# Altium schematic sheet амема.SchDoc
size A4; SheetNumber: 1; SheetTotal: 1
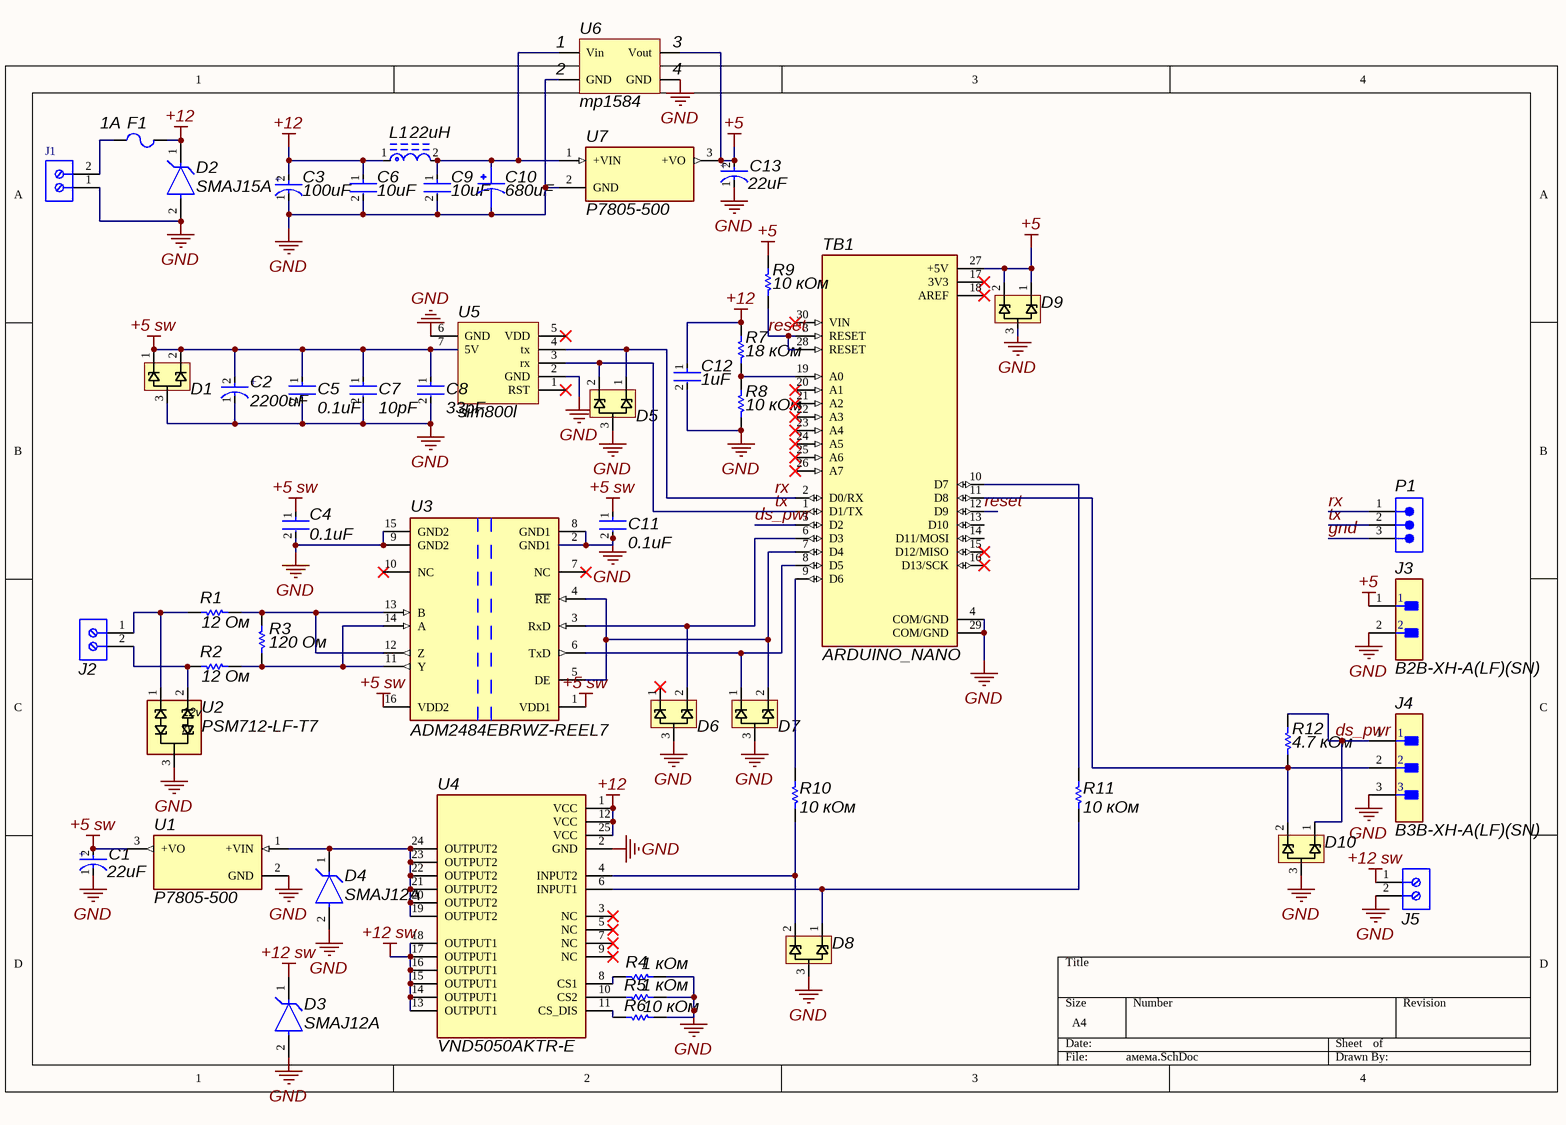
[diagram p0: амема.SchDoc]

## Parts
C1  Capacitance: 22uF  [FP-TAJA-MFG]  (hidden comment: TAJA226M006RNJ)
C2  Capacitance: 2200uF  [FP-250PX33MEFC10X20-MFG]  (hidden comment: 250PX33MEFC10X20)
C3  Capacitance: 100uF  [FP-250PX33MEFC10X20-MFG]  (hidden comment: 250PX33MEFC10X20)
C4  Capacitance: 0.1uF  [FP-GRM21B-0_1-MFG]  (hidden comment: GRM21BR61C106KE15L)
C5  Capacitance: 0.1uF  [FP-GRM21B-0_1-MFG]  (hidden comment: GRM21BR61C106KE15L)
C6  Capacitance: 10uF  [FP-GRM21B-0_1-MFG]  (hidden comment: GRM21BR61C106KE15L)
C7  Capacitance: 10pF  [FP-GRM21B-0_1-MFG]  (hidden comment: GRM21BR61C106KE15L)
C8  Capacitance: 33pF  [FP-GRM21B-0_1-MFG]  (hidden comment: GRM21BR61C106KE15L)
C9  Capacitance: 10uF  [FP-GRM21B-0_1-MFG]  (hidden comment: GRM21BR61C106KE15L)
C10  value 680uF  [CAPPRD500W60D1350H2200]  (hidden comment: UBT1H331MHD8)
C11  Capacitance: 0.1uF  [FP-GRM21B-0_1-MFG]  (hidden comment: GRM21BR61C106KE15L)
C12  Capacitance: 1uF  [FP-GRM21B-0_1-MFG]  (hidden comment: GRM21BR61C106KE15L)
C13  Capacitance: 22uF  [FP-TAJA-MFG]  (hidden comment: TAJA226M006RNJ)
D1  PESD5V2S2UT  [FP-6_541-5014_01-4-IPC_A]  (value not drawn)
D2  SMAJ15A  [FP-SMA-MFG]
D3  SMAJ12A  [FP-SMA-MFG]
D4  SMAJ12A  [FP-SMA-MFG]
D5  PESD5V2S2UT  [FP-6_541-5014_01-4-IPC_A]  (value not drawn)
D6  PESD5V2S2UT  [FP-6_541-5014_01-4-IPC_A]  (value not drawn)
D7  PESD5V2S2UT  [FP-6_541-5014_01-4-IPC_A]  (value not drawn)
D8  PESD5V2S2UT  [FP-6_541-5014_01-4-IPC_A]  (value not drawn)
D9  PESD5V2S2UT  [FP-6_541-5014_01-4-IPC_A]  (value not drawn)
D10  PESD5V2S2UT  [FP-6_541-5014_01-4-IPC_A]  (value not drawn)
F1  Current Rating: 1A  [LFUS-0215-20X5_L]  (hidden comment: 021502.5MXP)
J1  KSE-103-5.0-02P  [691211720002]  (value not drawn)
J2  691211720002  [691211720002]  (value not drawn)
J3  B2B-XH-A(LF)(SN)  [FP-B2B-XH-A_LF_SN-MFG]
J4  B3B-XH-A(LF)(SN)  [FP-B3B-XH-A_LF_SN-MFG]
J5  691211720002  [691211720002]  (value not drawn)
L1  Inductance: 22uH  [FP-RLB0914-MFG]  (hidden comment: RLB0914-220KL)
P1  61300311121  [61300311121]  (value not drawn)
R1  Resistance: 12 Ом  [RESC2013X70X40ML20T20]  (hidden comment: ERJ-6ENF1001V)
R2  Resistance: 12 Ом  [RESC2013X70X40ML20T20]  (hidden comment: ERJ-6ENF1001V)
R3  Resistance: 120 Ом  [RESC2013X70X40ML20T20]  (hidden comment: ERJ-6ENF1001V)
R4  Resistance: 1 кОм  [RESC2013X70X40ML20T20]  (hidden comment: ERJ-6ENF1001V)
R5  Resistance: 1 кОм  [RESC2013X70X40ML20T20]  (hidden comment: ERJ-6ENF1001V)
R6  Resistance: 10 кОм  [RESC2013X70X40ML20T20]  (hidden comment: ERJ-6ENF1001V)
R7  Resistance: 18 кОм  [RESC2013X70X40ML20T20]  (hidden comment: ERJ-6ENF1001V)
R8  Resistance: 10 кОм  [RESC2013X70X40ML20T20]  (hidden comment: ERJ-6ENF1001V)
R9  Resistance: 10 кОм  [RESC2013X70X40ML20T20]  (hidden comment: ERJ-6ENF1001V)
R10  Resistance: 10 кОм  [RESC2013X70X40ML20T20]  (hidden comment: ERJ-6ENF1001V)
R11  Resistance: 10 кОм  [RESC2013X70X40ML20T20]  (hidden comment: ERJ-6ENF1001V)
R12  Resistance: 4.7 кОм  [RESC2013X70X40ML20T20]  (hidden comment: ERJ-6ENF1001V)
TB1  ARDUINO_NANO  [SHIELD_ARDUINO_NANO]
U1  P7805-500  [CONV_P7805-500]
U2  PSM712-LF-T7  [PRKT-SOT23-3_V]
U3  ADM2484EBRWZ-REEL7  [FP-RW-16-IPC_B]
U4  VND5050AKTR-E  [FP-DB0024A-IPC_A]
U5  sim800l  [PCBComponent_1]
U6  mp1584  [dcdc 12 - 5]
U7  P7805-500  [CONV_P7805-500]

## Nets
+5: C13.2(A) D9.1(1_CATHODE) D9.2(2_CATHODE) J3.1 R9.2 TB1.27(+5V) U6.3(Vout) U7.3(+VO)
+5 sw: C1.2(A) C2.2(A) C4.1 C5.1 C7.1 C8.1 C11.1 D1.1(1_CATHODE) D1.2(2_CATHODE) U1.3(+VO) U3.1(VDD1) U3.16(VDD2) U5.7(5V)
+12: C3.2(A) C6.1 C12.1 D2.1(C) F1.2 L1.1 R7.2 U4.1(VCC) U4.12(VCC) U4.25(VCC)
+12 sw: D3.1(C) J5.1 U4.13(OUTPUT1) U4.14(OUTPUT1) U4.15(OUTPUT1) U4.16(OUTPUT1) U4.17(OUTPUT1) U4.18(OUTPUT1)
gnd: C1.1(C) C2.1(C) C3.1(C) C4.2 C5.2 C6.2 C7.2 C8.2 C9.2 C10.N(NEG) C11.2 C12.2 C13.1(C) D1.3(COMMON_ANODE) D2.2(A) D3.2(A) D4.2(A) D5.3(COMMON_ANODE) D6.3(COMMON_ANODE) D7.3(COMMON_ANODE) D8.3(COMMON_ANODE) D9.3(COMMON_ANODE) D10.3(COMMON_ANODE) J1.1 J3.2 J4.3 J5.2 P1.3 R4.1 R5.1 R6.1 R8.1 TB1.4(COM/GND) TB1.29(COM/GND) U1.2(GND) U2.3 U3.2(GND1) U3.8(GND1) U3.9(GND2) U3.15(GND2) U4.2(GND) U5.2(GND) U5.6(GND) U6.2(GND) U6.4(GND) U7.2(GND)
ds_pwr: D10.1(1_CATHODE) J4.1 R12.2 TB1.5(D2)
reset: R9.1 TB1.3(RESET) TB1.12(D9) TB1.28(RESET)
rx: D5.1(1_CATHODE) P1.1 TB1.2(D0/RX) U5.4(tx)
tx: D5.2(2_CATHODE) P1.2 TB1.1(D1/TX) U5.3(rx)
NetC9_1: C9.1 C10.P(POS) L1.2 U6.1(Vin) U7.1(+VIN)
NetD4_1: D4.1(C) U1.1(+VIN) U4.19(OUTPUT2) U4.20(OUTPUT2) U4.21(OUTPUT2) U4.22(OUTPUT2) U4.23(OUTPUT2) U4.24(OUTPUT2)
NetD6_2: D6.2(2_CATHODE) TB1.6(D3) U3.3(RxD)
NetD7_1: D7.1(1_CATHODE) TB1.8(D5) U3.6(TxD)
NetD7_2: D7.2(2_CATHODE) TB1.7(D4) U3.4(~{RE}) U3.5(DE)
NetD8_1: D8.1(1_CATHODE) R11.2 U4.6(INPUT1)
NetD8_2: D8.2(2_CATHODE) R10.2 U4.4(INPUT2)
NetD10_2: D10.2(2_CATHODE) J4.2 R12.1 TB1.11(D8)
NetF1_1: F1.1 J1.2
NetJ2_1: J2.1 R1.1 U2.1
NetJ2_2: J2.2 R2.1 U2.2
NetR1_2: R1.2 R3.2 U3.12(Z) U3.13(B)
NetR2_2: R2.2 R3.1 U3.11(Y) U3.14(A)
NetR4_2: R4.2 U4.8(CS1)
NetR5_2: R5.2 U4.10(CS2)
NetR6_2: R6.2 U4.11(CS_DIS)
NetR7_1: R7.1 R8.2 TB1.19(A0)
NetR10_1: R10.1 TB1.9(D6)
NetR11_1: R11.1 TB1.10(D7)

Not connected (* = marked no-connect by the designer): D6 1(1_CATHODE)*; TB1 13(D10) 14(D11/MOSI) 15(D12/MISO)* 16(D13/SCK)* 17(3V3)* 18(AREF)* 20(A1)* 21(A2)* 22(A3)* 23(A4)* 24(A5)* 25(A6)* 26(A7)* 30(VIN)*; U3 7(NC)* 10(NC)*; U4 3(NC)* 5(NC)* 7(NC)* 9(NC)*; U5 1(RST)* 5(VDD)*

## Notes on the sheet
- (in symbol CMP-01474-19991556-1) +
- (in symbol CMP-2000-07553-1) 12v; 7v
- (in symbol CMP-04424-000650-1) +

## Library data of the parts
C1 C13 = CMP-04424-000650-1: 22uF 6.3V  ±20% 3Ω 1206  SMD Tantalum Capacitor; Polarity: Polar; ESR (Equivalent Series Resistance): 3R; Leakage Current: 1.4uA; Dissipation Factor: 6%; Series: TAJ; Construction: Flat; Package Quantity: 1; Tolerance: 20%; Min Operating Temperature: -55°C; Height - Seated (Max): 0.071inch; Number of Pins: 2; Lead Free: Lead Free; Voltage Rating (DC): 6.3V; Height: 1.8mm; REACH SVHC: No SVHC; Length: 3.2mm; Case/Package: 1206; Max Operating Temperature: 125°C; Radiation Hardening: No; RoHS Compliant: Yes; Case Code (Metric): 3216; Voltage Rating: 6.3V; Mount: Surface Mount; Depth: 1.6mm; Case Code (Imperial): 1206; Packaging: Tape and Reel; Features: General Purpose; Width: 1.6mm; Termination: SMD/SMT
C2 C3 = CMP-01474-19991556-1: 250PX33MEFC10X20 Radial Can ALUMINUM ELECTROLYTIC CAPACITOR PX 250V 33muF ±20% 0.394Dia 10.00mm; Life (Hours): 2000hours; Ripple Current (AC): 140mA; Number of Pins: 2; Voltage Rating (DC): 250V; REACH SVHC: No SVHC; Min Operating Temperature: -40°C; Lead Pitch: 5.0038mm; Dissipation Factor: 20%; NexarPartId: 19991556; Width: 19.05mm; RoHS: Compliant; Height: 20mm; Height - Seated (Max): 21.9964mm; Diameter: 10mm; Voltage Rating: 250V; Case/Package: Radial; Mount: Through Hole; Weight: 4.717361g; Max Operating Temperature: 105°C; Tolerance: 20%; Length: 63.5mm; Ripple Current: 140mA
C4 C5 C11 = CMP-2007-03453-2: Chip Multilayer Ceramic Capacitors for General Purpose, 0805, 0.1uF, X5R, 15%, 10%, 16V; Radiation Hardening: No; Thickness: 0.053inch; Voltage Rating (DC): 16V; Lead Free: Lead Free; Package Quantity: 1; Width: 1.25mm; Case Code (Imperial): 0805; Depth: 1.25mm; Packaging: Tape and Reel; Dielectric: X5R; Max Operating Temperature: 85°C; Tolerance: 10%; Voltage Rating: 16V; Voltage: 16V; Height: 1.25mm; Case Code (Metric): 2012; Material: Ceramic; Mount: Surface Mount; Case/Package: 0805; REACH SVHC: No SVHC; Length: 2mm; Min Operating Temperature: -55°C; Termination: SMD/SMT
C6-C9 C12 = CMP-2007-03453-2: Chip Multilayer Ceramic Capacitors for General Purpose, 0805, 10uF, X5R, 15%, 10%, 16V; Radiation Hardening: No; Thickness: 0.053inch; Voltage Rating (DC): 16V; Lead Free: Lead Free; Package Quantity: 1; Width: 1.25mm; Case Code (Imperial): 0805; Depth: 1.25mm; Packaging: Tape and Reel; Dielectric: X5R; Max Operating Temperature: 85°C; Tolerance: 10%; Voltage Rating: 16V; Voltage: 16V; Height: 1.25mm; Case Code (Metric): 2012; Material: Ceramic; Mount: Surface Mount; Case/Package: 0805; REACH SVHC: No SVHC; Length: 2mm; Min Operating Temperature: -55°C; Termination: SMD/SMT
C10 = UBT1H331MHD8: 330 ÂµF 50 V Aluminum Electrolytic Capacitors Radial, Can - 10000 Hrs @ 125Â°C; MF: Nichicon; Price: None; MP: UBT1H331MHD8; Purchase-URL: https://pricing.snapeda.com/search/part/UBT1H331MHD8/?ref=eda; Package: Radial Nichicon; Check_prices: https://www.snapeda.com/parts/UBT1H331MHD8/Nichicon/view-part/?ref=eda; SnapEDA_Link: https://www.snapeda.com/parts/UBT1H331MHD8/Nichicon/view-part/?ref=snap; Availability: In Stock
D1 D5-D10 = CMP-02577-000002-1: TVS DIODE 5V  SOT23-3; Manufacturer: Vishay; Manufacturer Part Number: GSOT15C-E3-08; Peak Pulse Power: 345W; Automotive Grade: Grade 0; Max Junction Temp: +150°C; Reverse Standoff Voltage: 15V; Value: 35pF; Breakdown Voltage: 16.5V; Peak Pulse Current: 8A; Number Of Channels: 2; Clamping Voltage: 24.8V; Direction: Unidirectional; Category: Diode; Device Class L3: unset; ComponentLink2URL: http://www.vishay.com/docs/85824/gsot03c.pdf; Lead Free: Yes; Mouser Description: GSOT15C Series 12.3 V 120 pF SMT Bi-Directional ESD Protection Diode - SOT-23; Height: 1.15mm; Temperature Range High: +150°C; Automotive: Yes; RoHS: TRUE; ComponentLink2Description: Datasheet; Capacitance: 35pF; Device Class L1: Circuit Protection; Package: 6.541-5014.01-4; Octopart: https://octopart.com/gsot15c-e3-08-vishay-46467627; Device Class L2: TVS Diodes; Temperature: -55°C to +150°C; Temperature Range Low: -55°C; Digikey Description: TVS DIODE 15V 28.8V SOT23-3
D2 = CMP-07401-000026-1: TVS DIODE 15V 24.4V SMA; Manufacturer: Bourns Inc.; Max Junction Temp: +150°C; Peak Pulse Current: 16.4A; Direction: Unidirectional; Breakdown Voltage: 16.7V; Number Of Channels: 1; Peak Pulse Power: 400W; Mouser Description: Bourns Smaj15a / Diode Tvs 15v 400w Uni 5% Smd Bourns; Temperature Range Low: -55°C; ComponentLink2Description: Datasheet; Package: SMA; Reverse Standoff Voltage: 15V; Category: Diode; Device Class L2: TVS Diodes; Lead Free: Yes; RoHS: TRUE; Clamping Voltage: 24.4V; ComponentLink2URL: https://www.bourns.com/docs/Product-Datasheets/SMAJ.pdf; Digikey Description: TVS DIODE 15V 24.4V SMA; Temperature Range High: +150°C; Height: 2.29mm; Device Class L1: Circuit Protection; Device Class L3: unset; Temperature: -55°C to +150°C; Octopart: https://octopart.com/smaj15a-bourns-12809353; Manufacturer Part Number: SMAJ15A; Automotive: No
D3 D4 = CMP-07401-000026-1: TVS DIODE 15V 24.4V SMA; Manufacturer: Bourns Inc.; Manufacturer Part Number: SMAJ15A; Max Junction Temp: +150°C; Peak Pulse Current: 16.4A; Direction: Unidirectional; Breakdown Voltage: 16.7V; Number Of Channels: 1; Peak Pulse Power: 400W; Mouser Description: Bourns Smaj15a / Diode Tvs 15v 400w Uni 5% Smd Bourns; Temperature Range Low: -55°C; ComponentLink2Description: Datasheet; Package: SMA; Reverse Standoff Voltage: 15V; Category: Diode; Device Class L2: TVS Diodes; Lead Free: Yes; RoHS: TRUE; Clamping Voltage: 24.4V; ComponentLink2URL: https://www.bourns.com/docs/Product-Datasheets/SMAJ.pdf; Digikey Description: TVS DIODE 15V 24.4V SMA; Temperature Range High: +150°C; Height: 2.29mm; Device Class L1: Circuit Protection; Device Class L3: unset; Temperature: -55°C to +150°C; Octopart: https://octopart.com/smaj15a-bourns-12809353; Automotive: No
F1 = CMP-2000-05620-1: Time-Lag Type Cartridge Fuse, 1 A, 0.00386 Ohm, 250 V, -55 to 125 degC, 2-Pin SMD, RoHS, Bulk d5*20; Manufacturer: Littelfuse; Working Voltage-Max: 250V; Response Characteristic: TimeLag; Datasheet Version: 05/2016; Datasheet URL: http://www.littelfuse.com/~/media/electronics/datasheets/fuses/littelfuse_fuse_215_datasheet.pdf.pdf; Package Description: 2-Pin Surface Mount Device, Body 20 x 5.15 mm; Package Reference: 0215-20X5; Operating Temp Range: -55to+125°C; Size: 5x20mm; Manufacturer URL: http://www.littelfuse.com/; Mounting Technology: SurfaceMount
J1 J2 J5 = CMP-1502-02524-2: NexarPartId: 8917714; Number of Positions Per Level: 2; Wire Gauge (Min): 12AWG; Voltage: 300V; Connector Type: PCB, Terminal Block; Pitch: 5.0038mm; Current: 10A; Number of Levels: 1; Wire Gauge (Max): 24AWG; Plating: Brass, Steel; Stripping Length: -7mm; Width: 10mm; Min Operating Temperature: -40°C; Mount: Through Hole; Lead Pitch: 5mm; Max Operating Temperature: 105°C; Packaging: Box; Number of Contacts: 2; Length: 13.7mm; Height: 15.5mm; Color: Green; Number of Pins: 2; Wire/Cable Gauge: 12AWG; Housing Material: Nylon; REACH SVHC: Unknown; Contact Plating: Tin; RoHS: Compliant; Contact Material: Brass; Termination: Screw
J3 = CMP-2000-05888-3: CONN HEADER VERT 2POS 2.5MM; Current Rating: 3A; Voltage Rating: 250V; Number of Contacts: 2; Contact Resistance: 20mR; Wire/Cable Gauge: 22AWG; Insulation Resistance: 1GR; Connector Type: Male Pin; Packaging: Bulk; Contact Material: Brass; Lead Free: Lead Free; Orientation: Straight; Contact Plating: Tin; Max Current Rating: 3A; Termination: Solder; Fastening Type: Detent; Depth: 5.75mm; Housing Material: Polyamide; REACH SVHC: No SVHC; Series: XH; Voltage Rating (AC): 250V; Number of Positions: 2; Color: Natural; Contact Type: Male Pin; Max Voltage Rating (DC): 250V; Pitch: 2.5mm; Lead Pitch: 2.5mm; Mount: Through Hole; Max Operating Temperature: 85°C; Length: 7.4mm; Max Voltage Rating (AC): 250V; Min Operating Temperature: -25°C; Number of Rows: 1; Housing Color: White
J4 = CMP-17439-000014-3: CONN HEADER VERT 3POS 2.5MM; Max Voltage Rating (DC): 250V; Number of Positions: 3; Current Rating: 3A; Gender: Male; Wire/Cable Gauge: 22AWG; Contact Resistance: 20mR; Insulation Resistance: 1GR; Insulation Material: Nylon; Contact Plating: Tin; Depth: 5.75mm; Contact Type: Male Pin; Max Operating Temperature: 85°C; Insulation Color: Natural; Voltage Rating (AC): 250V; Color: Natural; Connector Type: Header; Orientation: Straight; Fastening Type: Detent; Housing Color: White; Min Operating Temperature: -25°C; Termination: Solder; Voltage Rating: 250V; Series: XH; Pitch: 2.5mm; Contact Shape: Square; Number of Rows: 1; Lead Free: Lead Free; Packaging: Bulk; Mount: Through Hole; Flammability Rating: UL94 V-0; Max Voltage Rating (AC): 250V; REACH SVHC: No SVHC; Housing Material: Polyamide; Contact Material: Brass; Lead Pitch: 2.5mm; Contact Finish - Mating: TIN; Length: 9.9mm; Max Current Rating: 3A; Number of Contacts: 3
L1 = CMP-07248-000080-1: FIXED IND 22UH 1.9A 90 MOHM TH; Test Frequency: 796kHz; Current Rating: 1A; Material: Steel; Lead/Base Style: Radial; Tolerance: 10%; Resistance: 280mR; Lead Diameter: 0.65mm; Self Resonant Frequency: 3.5MHz; Q Factor: 30; Shielding: Unshielded; Core Material: Ferrite; Radiation Hardening: No; Mount: Through Hole; Series: RLB; Inductance Tolerance: 10%; Package Quantity: 200; DC Resistance (DCR): 280mR; Max Operating Temperature: 105°C; REACH SVHC: No SVHC; Height - Seated (Max): 0.512inch; Military Standard: Not; Packaging: Bulk; Termination: Radial; Min Operating Temperature: -20°C; Height: 12mm; Max DC Current: 1A; Diameter: 8.7mm; Resistor Type: Wirewound; Lead Pitch: 5mm; Length: 12mm; Case/Package: Radial; Orientation: Vertical; DC Current: 1A; RMS Current (Irms): 1A
P1 = CMP-1502-01062-3: NexarPartId: 32855521; Current Rating: 3A; Voltage Rating: 250V; Number of Positions: 3; Pitch: 2.54mm; Contact Resistance: 20mΩ; Connector Type: Male Pin; Gender: Male; REACH SVHC: Unknown; Packaging: Bulk; Contact Material: Copper; Min Operating Temperature: -40°C; Number of Rows: 1; Orientation: Vertical; RoHS: Compliant; Contact Plating: Gold; Max Operating Temperature: 105°C; Mount: Through Hole; Height: 8.94mm; Operating Supply Voltage: 250V; Number of Pins: 3; Contact Mating Length: 5.9944mm; Number of Contacts: 3; Color: Black; Lead Free: Lead Free; Lead Pitch: 2.54mm; Termination: Solder
R1 R2 R4-R12 = CMP-2001-04375-5: Chip Resistor, 12 Ohm, +/- 1%, 0.125 W, -55 to 155 degC, 0805 (2012 Metric), RoHS, Tape and Reel; Manufacturer: Panasonic; Voltage Rating: 150 V; ComponentLink1URL: http://www.panasonic.com/; ComponentLink2Description: Datasheet; REACH SVHC: Yes; ComponentLink1Description: Manufacturer URL; Length: 2 mm; Height: 0.6 mm; Package Quantity: 1; PackageDescription: 2-Pin Surface Mount Device, Body 2 x 1.25 mm; Packaging: Cut Tape; PackageReference: 0805; Max Operating Temperature: 155 degC; Mounting Technology: Surface Mount; ComponentLink2URL: http://industrial.panasonic.com/cdbs/www-data/pdf/RDA0000/AOA0000C86.pdf; DatasheetVersion: 04/2015; Min Operating Temperature: -55 degC; Mount: Surface Mount
R3 = CMP-2001-04375-5: Chip Resistor, 120Ohm, +/- 1%, 0.125 W, -55 to 155 degC, 0805 (2012 Metric), RoHS, Tape and Reel; Manufacturer: Panasonic; Voltage Rating: 150 V; ComponentLink1URL: http://www.panasonic.com/; ComponentLink2Description: Datasheet; REACH SVHC: Yes; ComponentLink1Description: Manufacturer URL; Length: 2 mm; Height: 0.6 mm; Package Quantity: 1; PackageDescription: 2-Pin Surface Mount Device, Body 2 x 1.25 mm; Packaging: Cut Tape; PackageReference: 0805; Max Operating Temperature: 155 degC; Mounting Technology: Surface Mount; ComponentLink2URL: http://industrial.panasonic.com/cdbs/www-data/pdf/RDA0000/AOA0000C86.pdf; DatasheetVersion: 04/2015; Min Operating Temperature: -55 degC; Mount: Surface Mount
TB1 = ARDUINO_NANO: Small, complete, and breadboard-friendly board based on the ATmega328 (Arduino Nano 3.x); Check_prices: https://www.snapeda.com/parts/Arduino%20Nano/Arduino/view-part/?ref=eda; Value: *; Availability: Not in stock; MP: Arduino Nano; Price: None; Package: Non-Standard Arduino; SnapEDA_Link: https://www.snapeda.com/parts/Arduino%20Nano/Arduino/view-part/?ref=snap; MF: Arduino
U2 = CMP-2000-07553-1: TVS Array - Asymmetrical Data Line Protector, 600 W, 7.5 V, -55 to 150 degC, 3-Pin SOT23, RoHS, Tape and Reel; Manufacturer: Protek Devices; Min Breakdown Voltage: 7.5V; Direction: Bidirectional; Capacitance: 75pF; Current: 20uA; Power Dissipation: 600W; Working Voltage: 7V; Voltage: 12V; Case\/Package: SOT-23; Clamping Voltage: 17V; Element Configuration: Dual; Mounting Technology: SurfaceMount; RoHSCompliant: True; Radiation Hardening: No; Depth: 1.4mm; Lead Free: LeadFree; Package Description: 3-Pin Small Outline Transistor, Body 2.92 x 1.3 mm, Pitch 0.94 mm; Max Operating Temperature: 150degC; Length: 3.04mm; Manufacturer URL: http://www.protekdevices.com/; Min Operating Temperature: -55degC; Leakage Current: 20uA; Datasheet URL: www.protekdevices.com/xyz/documents/datasheets/psm712.pdf; Packaging: TapeandReel; Datasheet Version: 10/2013; Package Reference: SOT23-3; Number of Pins: 3
U3 = CMP-09096-000197-1: DGTL ISO 5KV RS422/RS485 16SOIC; Number of Transmitters: 1; Nominal Supply Current: 2mA; Simplex/Duplex: Full Duplex; Data Rate: 500Kbps; Min Supply Voltage: 3V; Logic Function: Transceiver; Number of Channels: 3; Isolated Power: No; Channel Type: Unidirectional; Max Supply Voltage: 5.5V; Isolation Voltage: 5kV; Number of Transceivers: 1; Number of Pins: 16; Packaging: Tape and Reel; Mount: Surface Mount; Min Operating Temperature: -40°C; Length: 10.5mm; Series: -; Package Quantity: 400; Operating Supply Voltage: 3V; Case/Package: SOIC; Supply Current: 2mA; RoHS Compliant: Yes; Max Operating Temperature: 85°C; Width: 7.6mm; Height: 2.35mm; Lead Free: Contains Lead; Number of Receivers: 1; Operating Supply Current: 2mA; Min Dual Supply Voltage: 3V
U4 = VND5050AKTR-E: Драйвер питания, VIPower M0-5, High-Side, Current Sense [PowerSSO-24]; Data Rate: 500Mbps; Number of Inputs: 8; Propagation Delay: 32.2ns; Polarity: Non-Inverting; High Level Output Current: -32mA; Logic Function: Translator; Output Current: 32mA; Turn-On Delay Time: 4.2ns; Number of Elements: 1; Min Supply Voltage: 1.65V; Direction: Bidirectional; Quiescent Current: 15uA; Max Supply Voltage: 5.5V; Width: 5.3mm; Number of Pins: 24; Lead Free: Lead Free; Case/Package: SSOP; REACH SVHC: No SVHC; Number of Bits: 8; Mount: Surface Mount; Radiation Hardening: No; Contact Plating: Gold; Height: 1.95mm; Number of Outputs: 8; Packaging: Tape and Reel; Low Level Output Current: 32mA; Min Operating Temperature: -40°C; Max Operating Temperature: 85°C; Length: 8.2mm; Package Quantity: 1; RoHS Compliant: Yes; Number of Channels: 8; Weight: 0.006081oz
U1 U7 = P7805-500: Availability: Unavailable; Price: None; Value: *; MP: P7805-500; Package: None